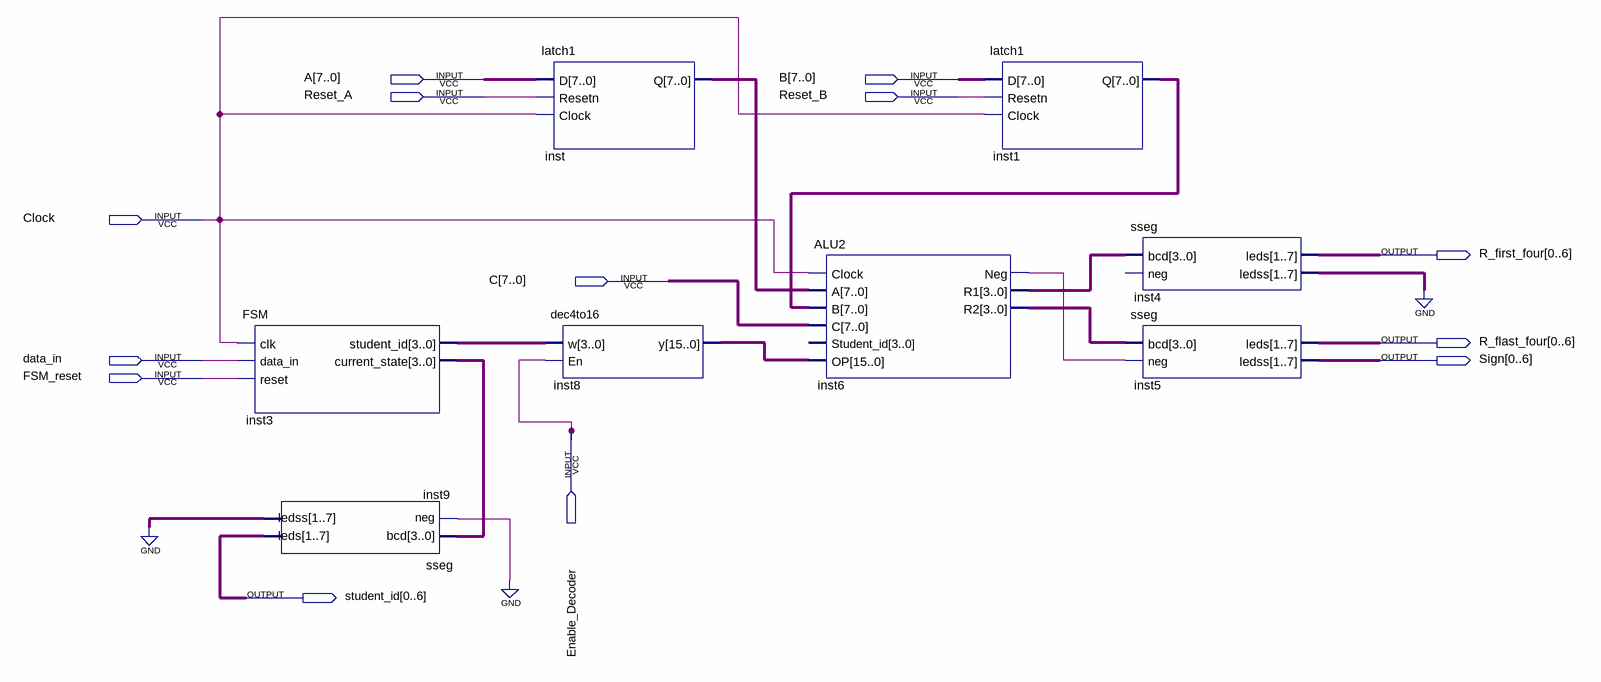
[diagram p0: schematic sheet]
// Quartus schematic Lab6Q2.bdf as structural Verilog: 8 symbols, 13 pins
module Lab6Q2 (
  input  [7:0] A,
  input  [7:0] B,
  input  Reset_A,
  input  Reset_B,
  input  Clock,
  input  [7:0] C,
  input  data_in,
  input  FSM_reset,
  input  Enable_Decoder,
  output [0:6] R_first_four,
  output [0:6] R_flast_four,
  output [0:6] Sign,
  output [0:6] student_id
);

  wire inst6_neg;
  wire [3:0] inst3_current_state, inst3_student_id, inst6_r1, inst6_r2;
  wire [6:0] inst4_ledss, inst9_ledss;
  wire [7:0] inst1_q, inst_q;
  wire [15:0] inst8_y;

  FSM inst3 (
    .clk(Clock), .data_in(data_in), .reset(FSM_reset), .student_id(inst3_student_id),
    .current_state(inst3_current_state));
  sseg inst9 (.bcd(inst3_current_state), .neg(1'b0), .leds(student_id), .ledss(inst9_ledss));
  latch1 inst (.D(A), .Resetn(Reset_A), .Clock(Clock), .Q(inst_q));
  dec4to16 inst8 (.w(inst3_student_id), .En(Enable_Decoder), .y(inst8_y));
  ALU2 inst6 (
    .Clock(Clock), .A(inst_q), .B(inst1_q), .C(C), .OP(inst8_y), .Neg(inst6_neg), .R1(inst6_r1), .R2(inst6_r2));  // open: Student_id
  latch1 inst1 (.D(B), .Resetn(Reset_B), .Clock(Clock), .Q(inst1_q));
  sseg inst4 (.bcd(inst6_r1), .leds(R_first_four), .ledss(inst4_ledss));  // open: neg
  sseg inst5 (.bcd(inst6_r2), .neg(inst6_neg), .leds(R_flast_four), .ledss(Sign));
  // also tied to GND on the sheet: {inst9_ledss[0], inst9_ledss[1], inst9_ledss[2], inst9_ledss[3], inst9_ledss[4], inst9_ledss[5], inst9_ledss[6], inst4_ledss[0], inst4_ledss[1], inst4_ledss[2], inst4_ledss[3], inst4_ledss[4], inst4_ledss[5], inst4_ledss[6]}
endmodule
